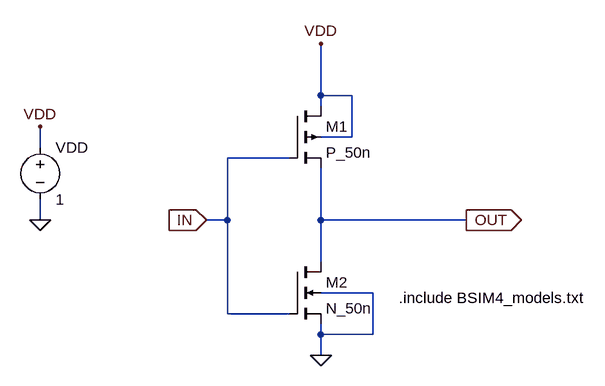
[diagram p0: schematic CMOS_ring.asc]
CMOS_ring.asc, the LTspice schematic file:
Version 4
SHEET 1 880 680
WIRE 272 64 272 -16
WIRE 320 64 272 64
WIRE 272 80 272 64
WIRE 320 128 320 64
WIRE 320 128 272 128
WIRE -160 144 -160 112
WIRE 224 160 128 160
WIRE -160 256 -160 224
WIRE 128 256 128 160
WIRE 128 256 96 256
WIRE 272 256 272 176
WIRE 496 256 272 256
WIRE 272 320 272 256
WIRE 352 368 272 368
WIRE 128 400 128 256
WIRE 224 400 128 400
WIRE 272 432 272 416
WIRE 352 432 352 368
WIRE 352 432 272 432
WIRE 272 464 272 432
FLAG -160 256 0
FLAG 272 464 0
FLAG 496 256 OUT
IOPIN 496 256 Out
FLAG 272 -16 VDD
FLAG -160 112 VDD
FLAG 96 256 IN
IOPIN 96 256 In
SYMBOL pmos4 224 80 R0
SYMATTR InstName M1
SYMATTR Value P_50n
SYMATTR Value2 l=50n w=1u
SYMBOL nmos4 224 320 R0
SYMATTR InstName M2
SYMATTR Value N_50n
SYMATTR Value2 l=50n w=500n
SYMBOL voltage -160 128 R0
WINDOW 123 0 0 Left 0
WINDOW 39 0 0 Left 0
SYMATTR InstName VDD
SYMATTR Value 1
TEXT 392 376 Left 2 !.include BSIM4_models.txt

The netlist it stands for:
* CMOS_ring.asc
M1 VDD IN OUT VDD P_50n l=50n w=1u
M2 OUT IN 0 0 N_50n l=50n w=500n
VDD VDD 0 1
.model NMOS NMOS
.model PMOS PMOS
.lib standard.mos
.include BSIM4_models.txt
.backanno
.end